# EAGLE schematic Tickler-Brains&Brawn (EAGLE 7.2.0)
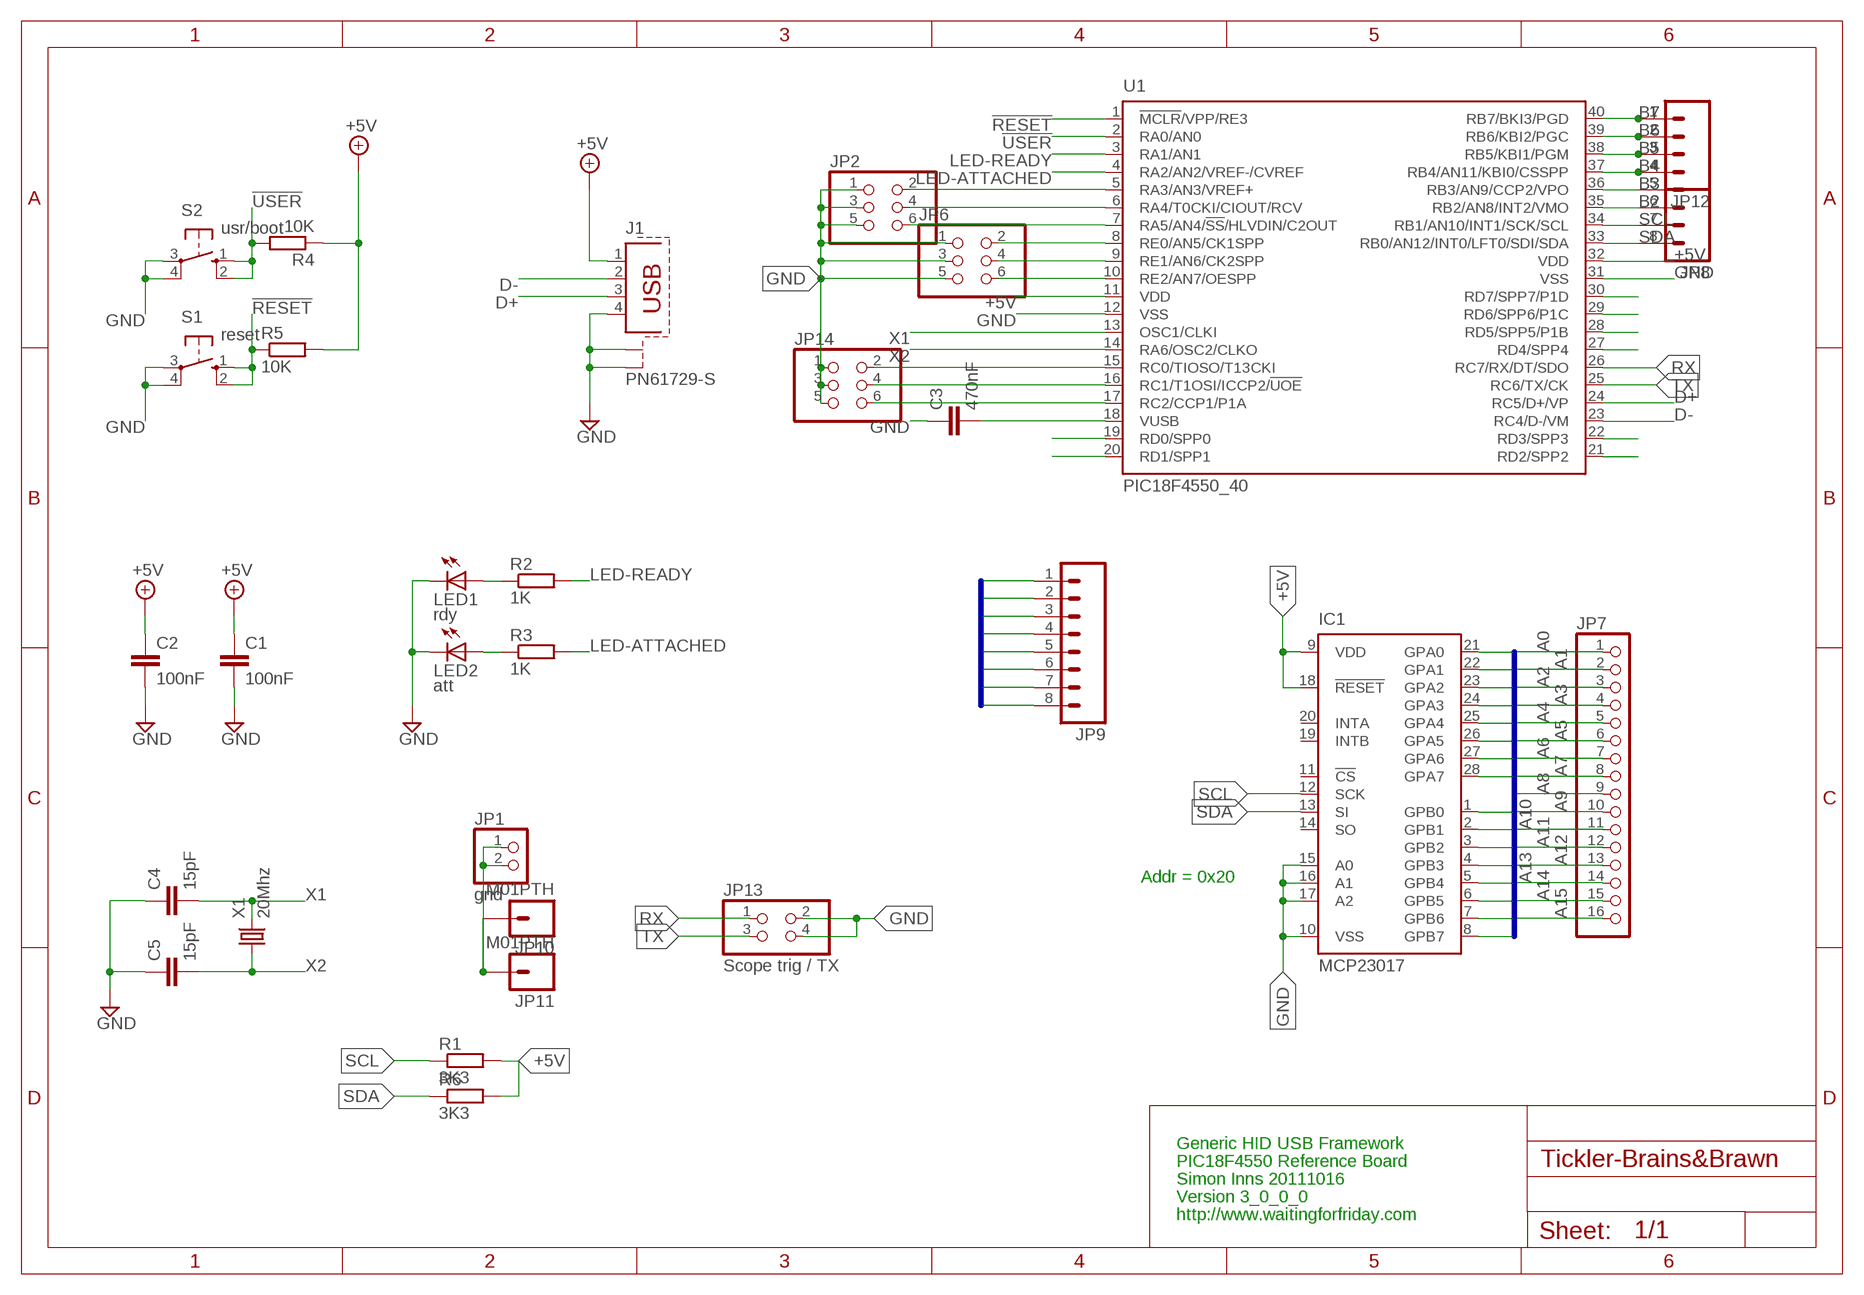
[diagram p0: schematic, sheet 1]

## Parts
C1  100nF  C-EU025-025X050  [C025-025X050]
C2  100nF  C-EU025-025X050  [C025-025X050]
C3  470nF  C-EU025-025X050  [C025-025X050]
C4  15pF  C-EU050-024X044  [C050-024X044]
C5  15pF  C-EU050-024X044  [C050-024X044]
IC1  MCP23017  MCP23S17SP  [DIL28-3]
J1  PN61729-S  [PN61729-S]
JP1  gnd  PINHD-1X2  [1X02]
JP2  PINHD-2X3  [2X03]
JP6  PINHD-2X3  [2X03]
JP7  PINHD-1X16  [1X16]
JP8  M08  [1X08]
JP9  M08  [1X08]
JP10  M01PTH  [1X01]
JP11  M01PTH  [1X01]
JP12  M04PTH  [1X04]
JP13  Scope trig / TX  PINHD-2X2  [2X02]
JP14  PINHD-2X3  [2X03]
LED1  rdy  LED3MM  [LED3MM]
LED2  att  LED3MM  [LED3MM]
R1  3K3  R-EU_0207/10  [0207/10]
R2  1K  R-EU_0207/10  [0207/10]
R3  1K  R-EU_0207/10  [0207/10]
R4  10K  R-EU_0207/10  [0207/10]
R5  10K  R-EU_0207/10  [0207/10]
R6  3K3  R-EU_0207/10  [0207/10]
S1  reset  10-XX  [B3F-10XX]
S2  usr/boot  10-XX  [B3F-10XX]
U1  PIC18F4550_40  [DIL40]
X1  20Mhz  CRYSTALHC49U-V  [HC49U-V]

## Nets
!RESET: R5.1 S1.1(S) S1.2(S1) U1.1(!MCLR!/VPP/RE3)
!USER: R4.2 S2.1(S) S2.2(S1) U1.2(RA0/AN0)
+5V: C1.1 C2.1 IC1.9(VDD) IC1.18(!RESET) J1.1 R1.2 R4.1 R5.2 R6.2 U1.11(VDD) U1.32(VDD)
A0: IC1.8(GPB7) JP7.1
A1: IC1.21(GPA0) JP7.2
A2: IC1.7(GPB6) JP7.3
A3: IC1.22(GPA1) JP7.4
A4: IC1.6(GPB5) JP7.5
A5: IC1.23(GPA2) JP7.6
A6: IC1.5(GPB4) JP7.7
A7: IC1.24(GPA3) JP7.8
A8: IC1.4(GPB3) JP7.9
A9: IC1.25(GPA4) JP7.10
A10: IC1.3(GPB2) JP7.11
A11: IC1.26(GPA5) JP7.12
A12: IC1.2(GPB1) JP7.13
A13: IC1.27(GPA6) JP7.14
A14: IC1.1(GPB0) JP7.15
A15: IC1.28(GPA7) JP7.16
B2: JP8.6 U1.35(RB2/AN8/INT2/VMO)
B3: JP8.5 U1.36(RB3/AN9/CCP2/VPO)
B4: JP8.4 JP12.4 U1.37(RB4/AN11/KBI0/CSSPP)
B5: JP8.3 JP12.3 U1.38(RB5/KBI1/PGM)
B6: JP8.2 JP12.2 U1.39(RB6/KBI2/PGC)
B7: JP8.1 JP12.1 U1.40(RB7/BKI3/PGD)
D0: JP9.1 U1.19(RD0/SPP0)
D1: JP9.2 U1.20(RD1/SPP1)
D2: JP9.3 U1.21(RD2/SPP2)
D3: JP9.4 U1.22(RD3/SPP3)
D4: JP9.5 U1.27(RD4/SPP4)
D5: JP9.6 U1.28(RD5/SPP5/P1B)
D6: JP9.7 U1.29(RD6/SPP6/P1C)
D7: JP9.8 U1.30(RD7/SPP7/P1D)
D+: J1.3 U1.24(RC5/D+/VP)
D-: J1.2 U1.23(RC4/D-/VM)
GND: C1.2 C2.2 C3.1 C4.1 C5.1 IC1.10(VSS) IC1.15(A0) IC1.16(A1) IC1.17(A2) J1.4 J1.S1 J1.S2 JP1.1 JP1.2 JP2.1 JP2.3 JP2.5 JP6.1 JP6.3 JP6.5 JP10.1 JP11.1 JP13.2 JP13.4 JP14.1 JP14.3 JP14.5 LED1.K(C) LED2.K(C) S1.3(P) S1.4(P1) S2.3(P) S2.4(P1) U1.12(VSS) U1.31(VSS)
LED-ATTACHED: R3.2 U1.4(RA2/AN2/VREF-/CVREF)
LED-READY: R2.2 U1.3(RA1/AN1)
N$2: LED1.A R2.1
N$3: LED2.A R3.1
N$11: C3.2 U1.18(VUSB)
N$12: JP6.6 U1.10(RE2/AN7/OESPP)
N$13: JP6.4 U1.9(RE1/AN6/CK2SPP)
N$14: JP6.2 U1.8(RE0/AN5/CK1SPP)
N$15: JP2.6 U1.7(RA5/AN4/!SS!/HLVDIN/C2OUT)
N$16: JP2.4 U1.6(RA4/T0CKI/CIOUT/RCV)
N$17: JP2.2 U1.5(RA3/AN3/VREF+)
N$18: JP14.6 U1.17(RC2/CCP1/P1A)
N$19: JP14.4 U1.16(RC1/T1OSI/ICCP2/!UOE)
N$20: JP14.2 U1.15(RC0/TIOSO/T13CKI)
RX: JP13.1 U1.26(RC7/RX/DT/SDO)
SCL: IC1.12(SCK) JP8.7 R1.1 U1.34(RB1/AN10/INT1/SCK/SCL)
SDA: IC1.13(SI) JP8.8 R6.1 U1.33(RB0/AN12/INT0/LFT0/SDI/SDA)
TX: JP13.3 U1.25(RC6/TX/CK)
X1: C4.2 U1.13(OSC1/CLKI) X1.2
X2: C5.2 U1.14(RA6/OSC2/CLKO) X1.1
Unconnected: IC1.11(!CS) IC1.14(SO) IC1.19(INTB) IC1.20(INTA)

## Buses
A[0..15]
D[0..7]

## Notes on the sheet
- Addr = 0x20
- Generic HID USB Framework
- PIC18F4550 Reference Board
- Simon Inns 20111016
- Version 3_0_0_0
- http://www.waitingforfriday.com

## Library data of the parts
C1-C5 = rcl:C-EU: CAPACITOR, European symbol
IC1 = microchip:MCP23S17: http://ww1.microchip.com/downloads/en/DeviceDoc/21952a.pdf Source: http://ww1.microchip.com/downloads/en/DeviceDoc/21952a.pdf; MF: MICROCHIP; MPN: MCP23S17-E/SP; OC_FARNELL: 1292238; OC_NEWARK: 31K2951
J1 = con-berg:PN61729-S: BERG USB connector; OC_FARNELL: unknown; OC_NEWARK: unknown
JP1 = pinhead:PINHD-1X2: PIN HEADER
JP2 JP6 JP14 = pinhead:PINHD-2X3: PIN HEADER
JP7 = pinhead:PINHD-1X16: PIN HEADER
JP8 JP9 = SparkFun:M08: Header 8 Standard 8-pin 0.1" header. Use with straight break away headers (SKU : PRT-00116), right angle break away headers (PRT-00553), swiss pins (PRT-00743), machine pins (PRT-00117), and female headers (PRT-00115).
JP10 JP11 = SparkFun:M01: Header 1 Standard 1-pin 0.1" header. Use with straight break away headers (SKU : PRT-00116), right angle break away headers (PRT-00553), swiss pins (PRT-00743), machine pins (PRT-00117), and female headers (PRT-00115).
JP12 = SparkFun:M04: Header 4 Standard 4-pin 0.1" header. Use with straight break away headers (SKU : PRT-00116), right angle break away headers (PRT-00553), swiss pins (PRT-00743), machine pins (PRT-00117), and female headers (PRT-00115). Molex polarized connector foot print use with SKU : PRT-08231 with associated crimp pins and housings.
JP13 = pinhead:PINHD-2X2: PIN HEADER
LED1 LED2 = led:LED: LED OSRAM: - CHIPLED LG R971, LG N971, LY N971, LG Q971, LY Q971, LO R971, LY R971 LH N974, LH R974 LS Q976, LO Q976, LY Q976 LO Q996 - Hyper CHIPLED LW Q18S LB Q993, LB Q99A, LB R99A - SideLED LS A670, LO A670, LY A670, LG A670, LP A670 LB A673, LV A673, LT A673, LW A673 LH A674 LY A675 LS A676, LA A676, LO A676, LY A676, LW A676 LS A679, LY A679, LG A679 - Hyper Micro SIDELED® LS Y876, LA Y876, LO Y876, LY Y876 LT Y87S - SmartLED LW L88C, LW L88S LB L89C, LB L89S, LG L890 LS L89K, LO L89K, LY L89K LS L896, LA L896, LO L896, LY L896 - TOPLED LS T670, LO T670, LY T670, LG T670, LP T670 LSG T670, LSP T670, LSY T670, LOP T670, LYG T670 LG T671, LOG T671, LSG T671 LB T673, LV T673, LT T673, LW T673 LH T674 LS T676, LA T676, LO T676, LY T676, LB T676, LH T676, LSB T676, LW T676 LB T67C, LV T67C, LT T67C, LS T67K, LO T67K, LY T67K, LW E67C LS E67B, LA E67B, LO E67B, LY E67B, LB E67C, LV E67C, LT E67C LW T67C LS T679, LY T679, LG T679 LS T770, LO T770, LY T770, LG T770, LP T770 LB T773, LV T773, LT T773, LW T773 LH T774 LS E675, LA E675, LY E675, LS T675 LS T776, LA T776, LO T776, LY T776, LB T776 LHGB T686 LT T68C, LB T68C - Hyper Mini TOPLED® LB M676 - Mini TOPLED Santana® LG M470 LS M47K, LO M47K, LY M47K Source: http://www.osram.convergy.de LUXEON: - LUMILED® LXK2-PW12-R00, LXK2-PW12-S00, LXK2-PW14-U00, LXK2-PW14-V00 LXK2-PM12-R00, LXK2-PM12-S00, LXK2-PM14-U00 LXK2-PE12-Q00, LXK2-PE12-R00, LXK2-PE12-S00, LXK2-PE14-T00, LXK2-PE14-U00 LXK2-PB12-K00, LXK2-PB12-L00, LXK2-PB12-M00, LXK2-PB14-N00, LXK2-PB14-P00, LXK2-PB14-Q00 LXK2-PR12-L00, LXK2-PR12-M00, LXK2-PR14-Q00, LXK2-PR14-R00 LXK2-PD12-Q00, LXK2-PD12-R00, LXK2-PD12-S00 LXK2-PH12-R00, LXK2-PH12-S00 LXK2-PL12-P00, LXK2-PL12-Q00, LXK2-PL12-R00 Source: www.luxeon.com KINGBRIGHT: KA-3528ASYC Source: www.kingbright.com
R1-R6 = rcl:R-EU_: RESISTOR, European symbol
S1 S2 = switch-omron:10-XX: OMRON SWITCH; MPN: B3F-1000; OC_FARNELL: 176432; OC_NEWARK: 36M3542
U1 = microchip:PIC18F4*_40: USB Microcontrollers with nanoWatt Technology High-Performance, Enhanced Flash, 28/40/44-Pin, Source: http://ww1.microchip.com/downloads/en/devicedoc/39632c.pdf; MF: MICROCHIP; MPN: PIC18F4550-I/P; OC_FARNELL: 9321357; OC_NEWARK: 74K8623
X1 = crystal:CRYSTAL: CRYSTAL; OC_FARNELL: 1666969; OC_NEWARK: unknown